# EAGLE schematic badge_rev03 (EAGLE 5.06)
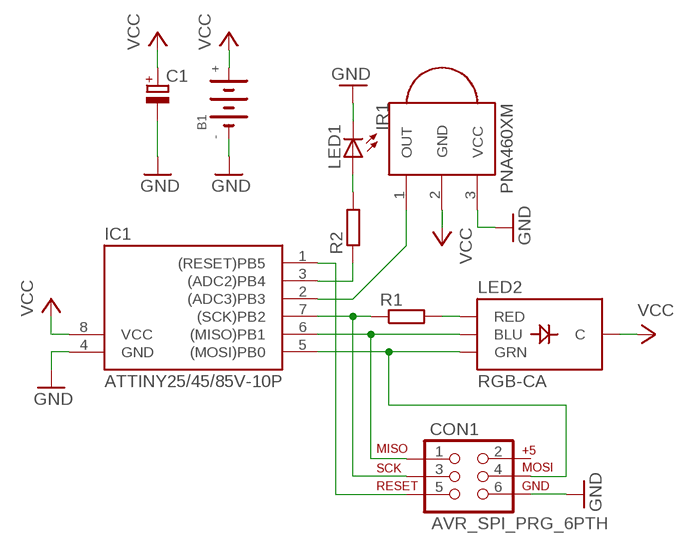
[diagram p0: schematic, sheet 1]

## Parts
B1  BATTERYCR2032  [CR2032]
C1  CPOL-EUE2.5-6  [E2,5-6]
CON1  AVR_SPI_PRG_6PTH  [2X3]
IC1  ATTINY25/45/85V-10P  TINY138P3  [DIL08]
IR1  PNA460XM  [PNA460XM]
LED1  LED5MM  [LED5MM]
LED2  RGB-CA  LED-TRICOLOR-THROUGHHOLE  [LED-TRICOLOR-THROUGHHOLE]
R1  R-EU_0207/7  [0207/7]
R2  R-EU_0207/7  [0207/7]

## Nets
GND: B1.- C1.- CON1.6 IC1.4(GND) IR1.3(VCC) LED1.K(C)
N$1: CON1.3 IC1.7((SCK)PB2) R1.1
N$2: LED2.RED R1.2
N$3: CON1.4 IC1.5((MOSI)PB0) LED2.GRN
N$4: CON1.1 IC1.6((MISO)PB1) LED2.BLU
N$5: IC1.3((ADC2)PB4) R2.1
N$6: IC1.2((ADC3)PB3) IR1.1(OUT)
N$7: LED1.A R2.2
N$9: CON1.5 IC1.1((RESET)PB5)
VCC: B1.+ C1.+ IC1.8(VCC) IR1.2(GND) LED2.GND(C)
Unconnected: CON1.2

## Library data of the parts
B1 = microbuilder:BATTERY
C1 = rcl:CPOL-EU: POLARIZED CAPACITOR, European symbol
CON1 = SparkFun:AVR_SPI_PRG_6: AVR ISP 6 Pin This is the reduced ISP connector for AVR programming. Common on Arduino. This footprint will take up less PCB space and can be used with a 10-pin to 6-pin adapter such as SKU: BOB-08508
IC1 = avr-4:TINY13*
IR1 = adafruit:PNA460XM: IR 38KHz receiver PNA4602 and related receivers http://www.ladyada.net/library/pcb/eaglelibrary.html
LED1 = led:LED: LED OSRAM: - CHIPLED LG R971, LG N971, LY N971, LG Q971, LY Q971, LO R971, LY R971 LH N974, LH R974 LS Q976, LO Q976, LY Q976 LO Q996 - Hyper CHIPLED LW Q18S LB Q993, LB Q99A, LB R99A - SideLED LS A670, LO A670, LY A670, LG A670, LP A670 LB A673, LV A673, LT A673, LW A673 LH A674 LY A675 LS A676, LA A676, LO A676, LY A676, LW A676 LS A679, LY A679, LG A679 - Hyper Micro SIDELED® LS Y876, LA Y876, LO Y876, LY Y876 LT Y87S - SmartLED LW L88C, LW L88S LB L89C, LB L89S, LG L890 LS L89K, LO L89K, LY L89K LS L896, LA L896, LO L896, LY L896 - TOPLED LS T670, LO T670, LY T670, LG T670, LP T670 LSG T670, LSP T670, LSY T670, LOP T670, LYG T670 LG T671, LOG T671, LSG T671 LB T673, LV T673, LT T673, LW T673 LH T674 LS T676, LA T676, LO T676, LY T676, LB T676, LH T676, LSB T676, LW T676 LB T67C, LV T67C, LT T67C, LS T67K, LO T67K, LY T67K, LW E67C LS E67B, LA E67B, LO E67B, LY E67B, LB E67C, LV E67C, LT E67C LW T67C LS T679, LY T679, LG T679 LS T770, LO T770, LY T770, LG T770, LP T770 LB T773, LV T773, LT T773, LW T773 LH T774 LS E675, LA E675, LY E675, LS T675 LS T776, LA T776, LO T776, LY T776, LB T776 LHGB T686 LT T68C, LB T68C - Hyper Mini TOPLED® LB M676 - Mini TOPLED Santana® LG M470 LS M47K, LO M47K, LY M47K Source: http://www.osram.convergy.de LUXEON: - LUMILED® LXK2-PW12-R00, LXK2-PW12-S00, LXK2-PW14-U00, LXK2-PW14-V00 LXK2-PM12-R00, LXK2-PM12-S00, LXK2-PM14-U00 LXK2-PE12-Q00, LXK2-PE12-R00, LXK2-PE12-S00, LXK2-PE14-T00, LXK2-PE14-U00 LXK2-PB12-K00, LXK2-PB12-L00, LXK2-PB12-M00, LXK2-PB14-N00, LXK2-PB14-P00, LXK2-PB14-Q00 LXK2-PR12-L00, LXK2-PR12-M00, LXK2-PR14-Q00, LXK2-PR14-R00 LXK2-PD12-Q00, LXK2-PD12-R00, LXK2-PD12-S00 LXK2-PH12-R00, LXK2-PH12-S00 LXK2-PL12-P00, LXK2-PL12-Q00, LXK2-PL12-R00 Source: www.luxeon.com KINGBRIGHT: KA-3528ASYC Source: www.kingbright.com
LED2 = SparkFun:LED-TRICOLOR-THROUGHHOLE
R1 R2 = rcl:R-EU_: RESISTOR, European symbol